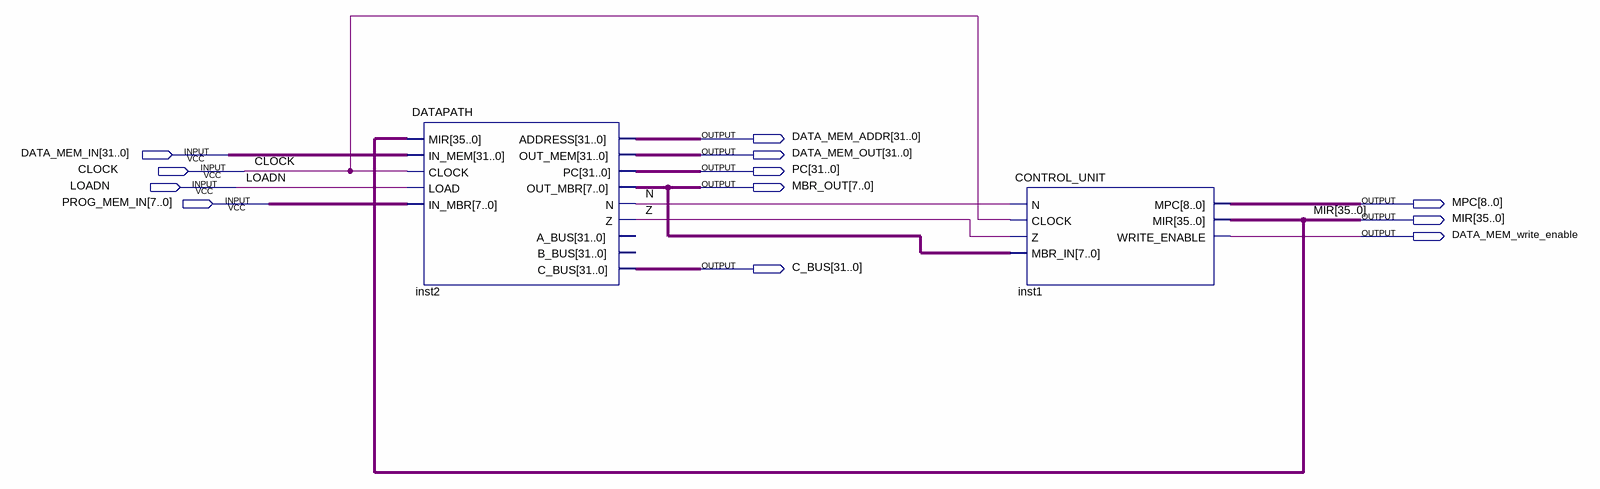
[diagram p0: schematic sheet]
// Quartus schematic CPU.bdf as structural Verilog: 2 symbols, 12 pins
module CPU (
  input  [31:0] DATA_MEM_IN,
  input  CLOCK,
  input  LOADN,
  input  [7:0] PROG_MEM_IN,
  output [31:0] DATA_MEM_ADDR,
  output [31:0] DATA_MEM_OUT,
  output [31:0] PC,
  output [7:0] MBR_OUT,
  output [8:0] MPC,
  output [35:0] MIR,
  output DATA_MEM_write_enable,
  output [31:0] C_BUS
);

  wire N, Z;

  DATAPATH inst2 (
    .MIR(MIR), .IN_MEM(DATA_MEM_IN), .CLOCK(CLOCK), .LOAD(LOADN), .IN_MBR(PROG_MEM_IN),
    .ADDRESS(DATA_MEM_ADDR), .OUT_MEM(DATA_MEM_OUT), .PC(PC), .OUT_MBR(MBR_OUT), .N(N), .Z(Z), .C_BUS(C_BUS));  // open: A_BUS, B_BUS
  CONTROL_UNIT inst1 (
    .N(N), .CLOCK(CLOCK), .Z(Z), .MBR_IN(MBR_OUT), .MPC(MPC), .MIR(MIR), .WRITE_ENABLE(DATA_MEM_write_enable));
endmodule
